# Altium schematic sheet Bluetooth.SchDoc
size A4; SheetNumber: 3
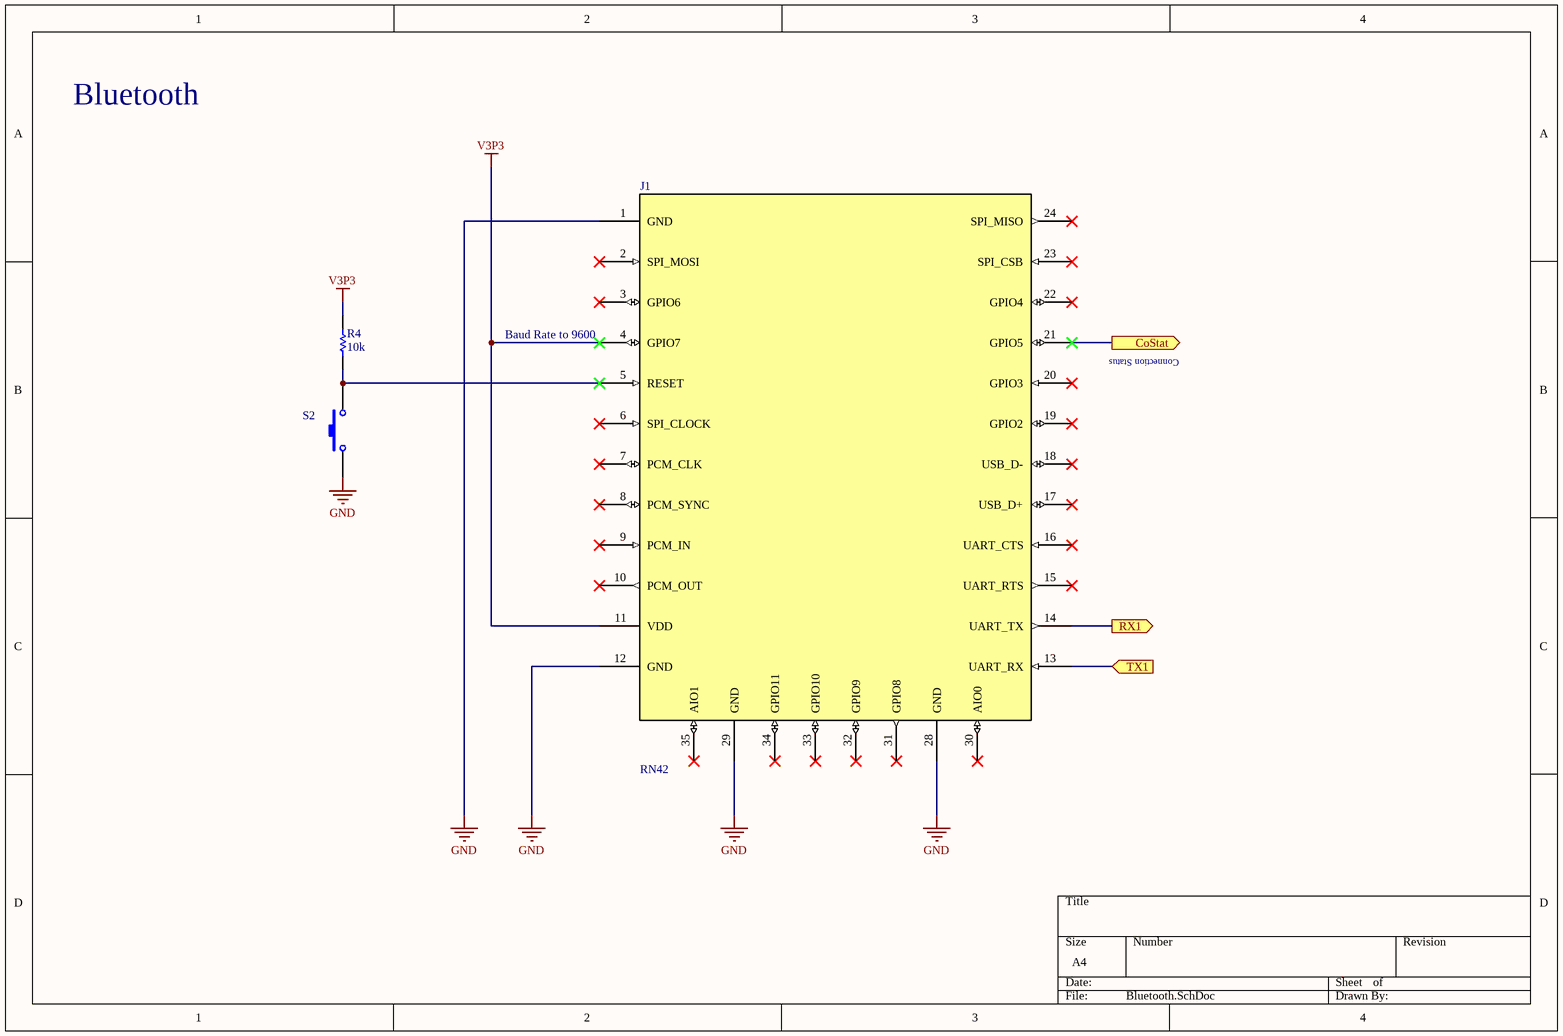
[diagram p0: Bluetooth.SchDoc]

## Parts
J1  RN42  [RN42]
R4  10k  [own_0603]
S2  Switch  [DPST-4]  (value not drawn)

## Ports
CoStat (out), RX1 (out), TX1 (in)

## Nets
GND: J1.1(GND) J1.12(GND) J1.28(GND) J1.29(GND) S2.1
V3P3: J1.4(GPIO7) J1.11(VDD) R4.2
CoStat: J1.21(GPIO5) ; port CoStat
RX1: J1.14(UART_TX) ; port RX1
TX1: J1.13(UART_RX) ; port TX1
NetJ1_5: J1.5(RESET) R4.1 S2.2

Not connected (* = marked no-connect by the designer): J1 2(SPI_MOSI)* 3(GPIO6)* 6(SPI_CLOCK)* 7(PCM_CLK)* 8(PCM_SYNC)* 9(PCM_IN)* 10(PCM_OUT)* 15(UART_RTS)* 16(UART_CTS)* 17(USB_D+)* 18(USB_D-)* 19(GPIO2)* 20(GPIO3)* 22(GPIO4)* 23(SPI_CSB)* 24(SPI_MISO)* 30(AIO0)* 31(GPIO8)* 32(GPIO9)* 33(GPIO10)* 34(GPIO11)* 35(AIO1)*

## Notes on the sheet
- Bluetooth
- (near J1) Baud Rate to 9600
- Connection Status

## Library data of the parts
J1 = RN42: Bluetooth Module; Fabricant: Microchip; RefFabricant: RN42-I/RM; Fournisseur: Farnell; RefFournisseur: 2143310
R4 = Res1: Resistor; Published: 8-Jun-2000; LatestRevisionDate: 17-Jul-2002; LatestRevisionNote: Re-released for DXP Platform.; PackageReference: AXIAL-0.3; Publisher: Altium Limited; PackageDescription: Axial Device, Thru-Hole; 2 Leads; 0.3 in Pin Spacing
S2 = SW-PB: Reset; Published: 24-Mar-1999; LatestRevisionDate: 17-Jul-2002; LatestRevisionNote: Re-released for DXP Platform.; PackageReference: SPST-2; Publisher: Altium Limited; PackageDescription: Switch; 2 Leads